# Altium project Inverter_AXIOMA_ REVERS.PrjPcb
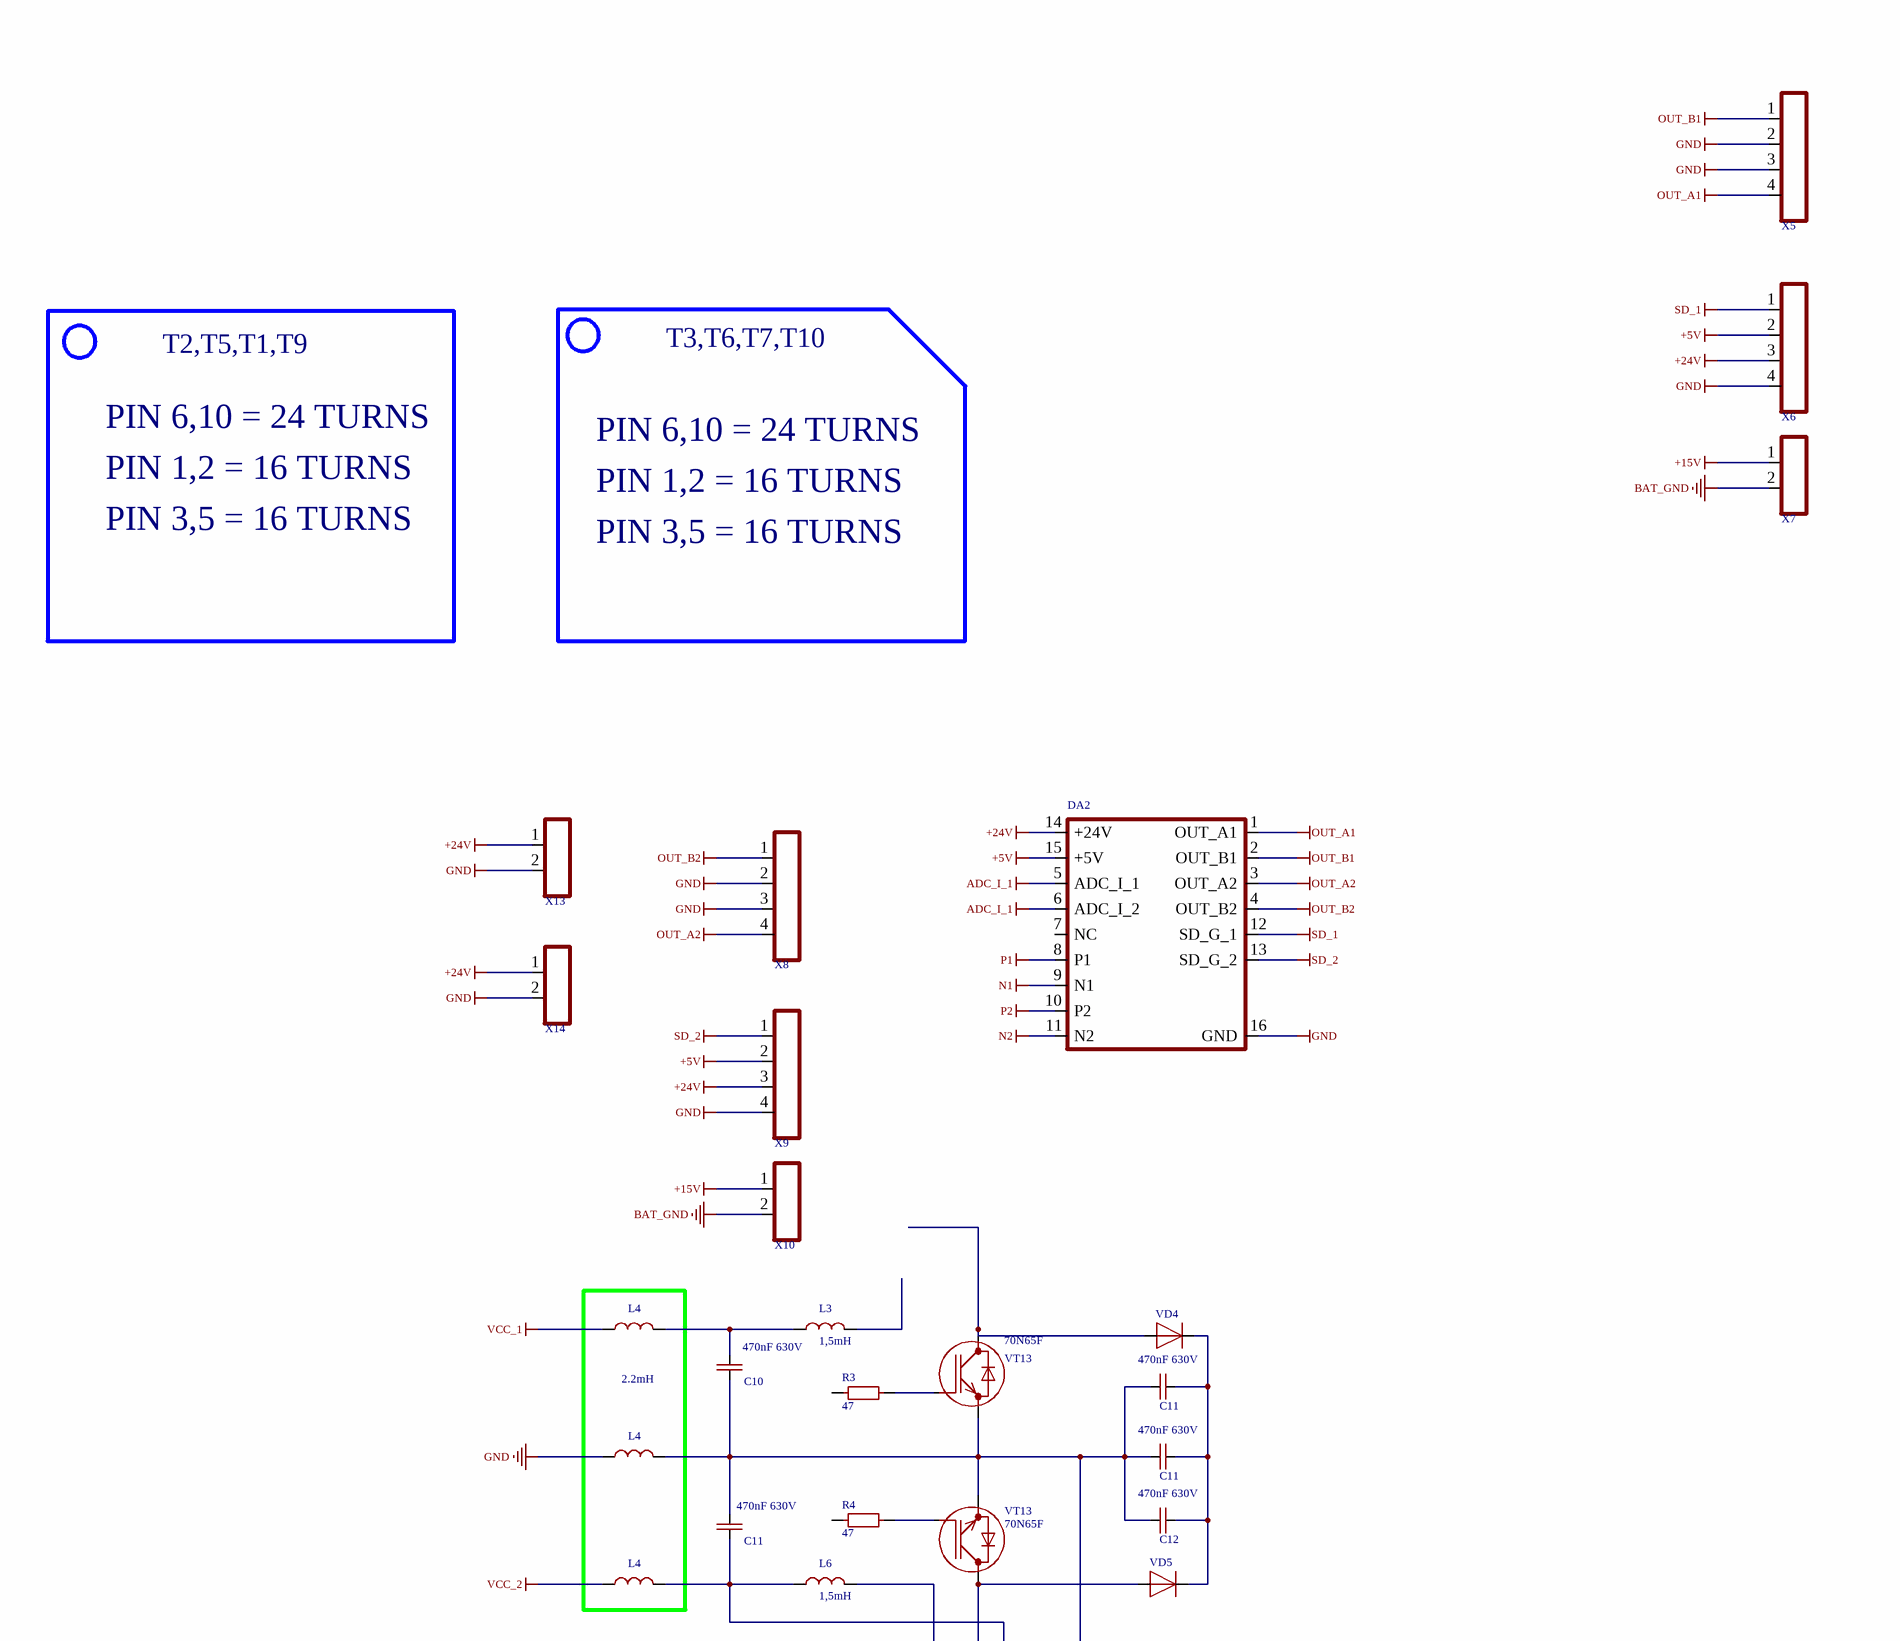
[diagram p0: Inverter_AXIOMA_ REVERS.SchDoc, top left]
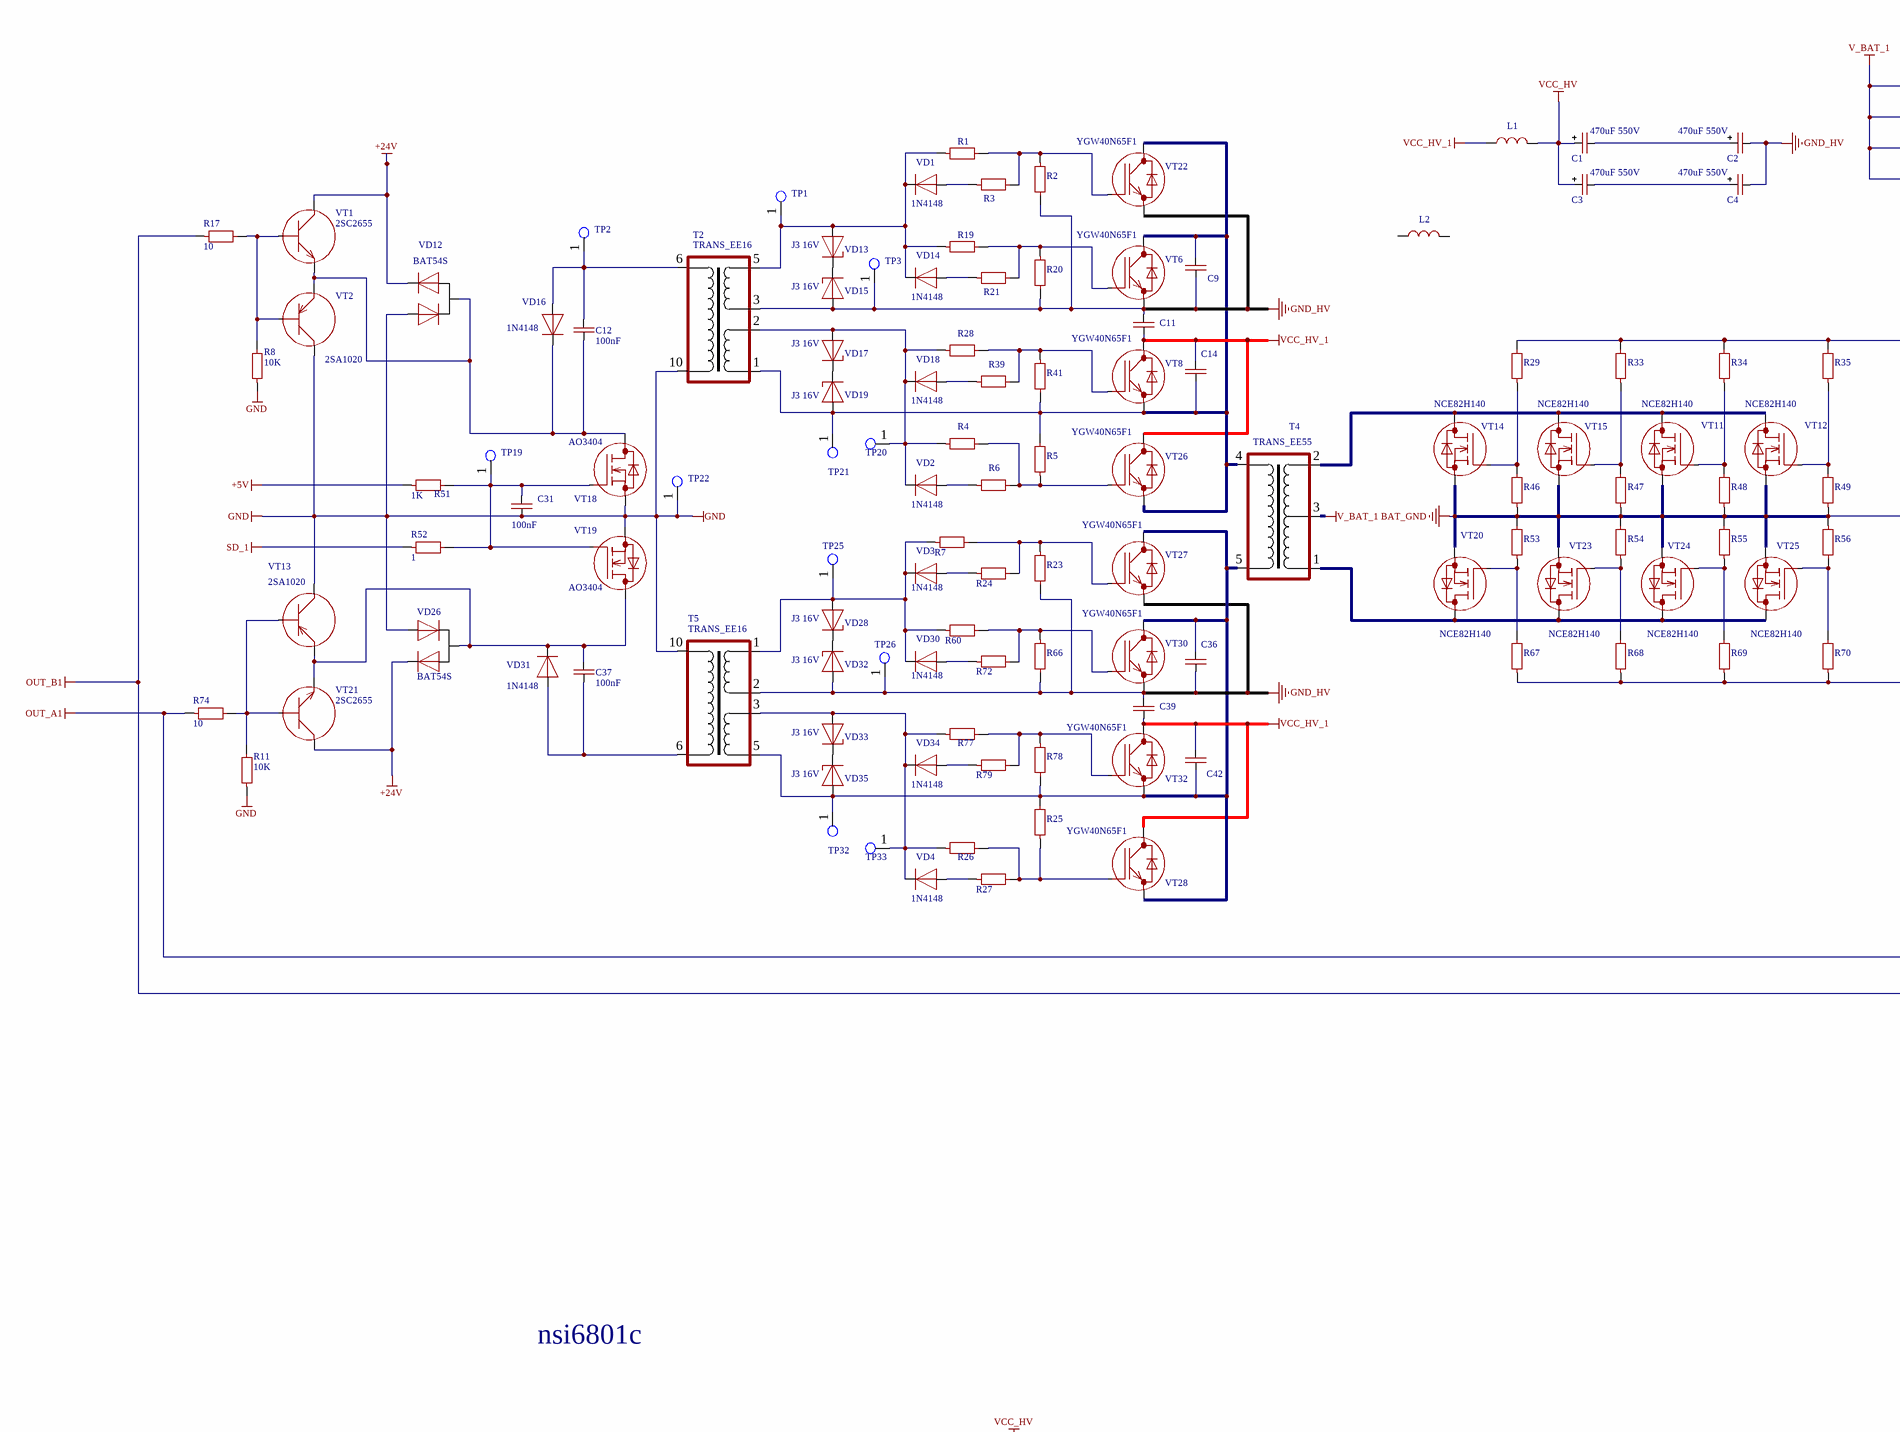
[diagram p1: Inverter_AXIOMA_ REVERS.SchDoc, top middle]
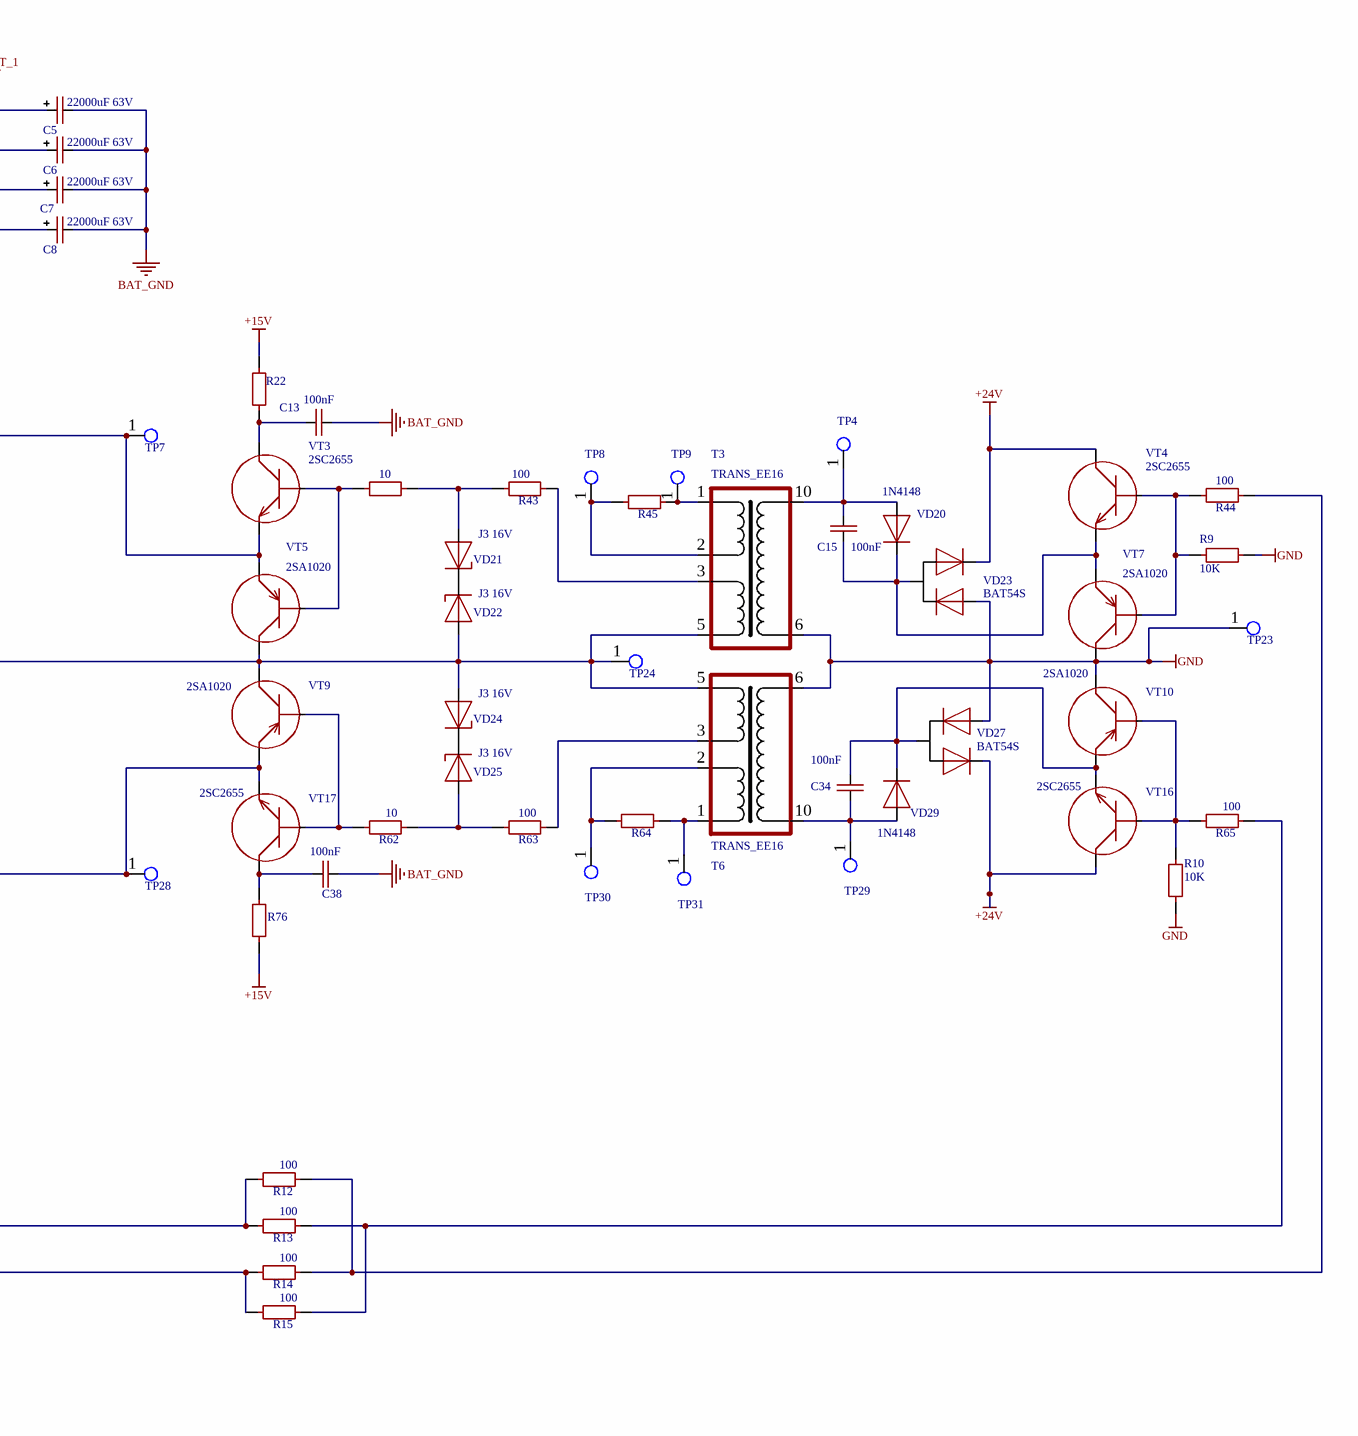
[diagram p2: Inverter_AXIOMA_ REVERS.SchDoc, top right]
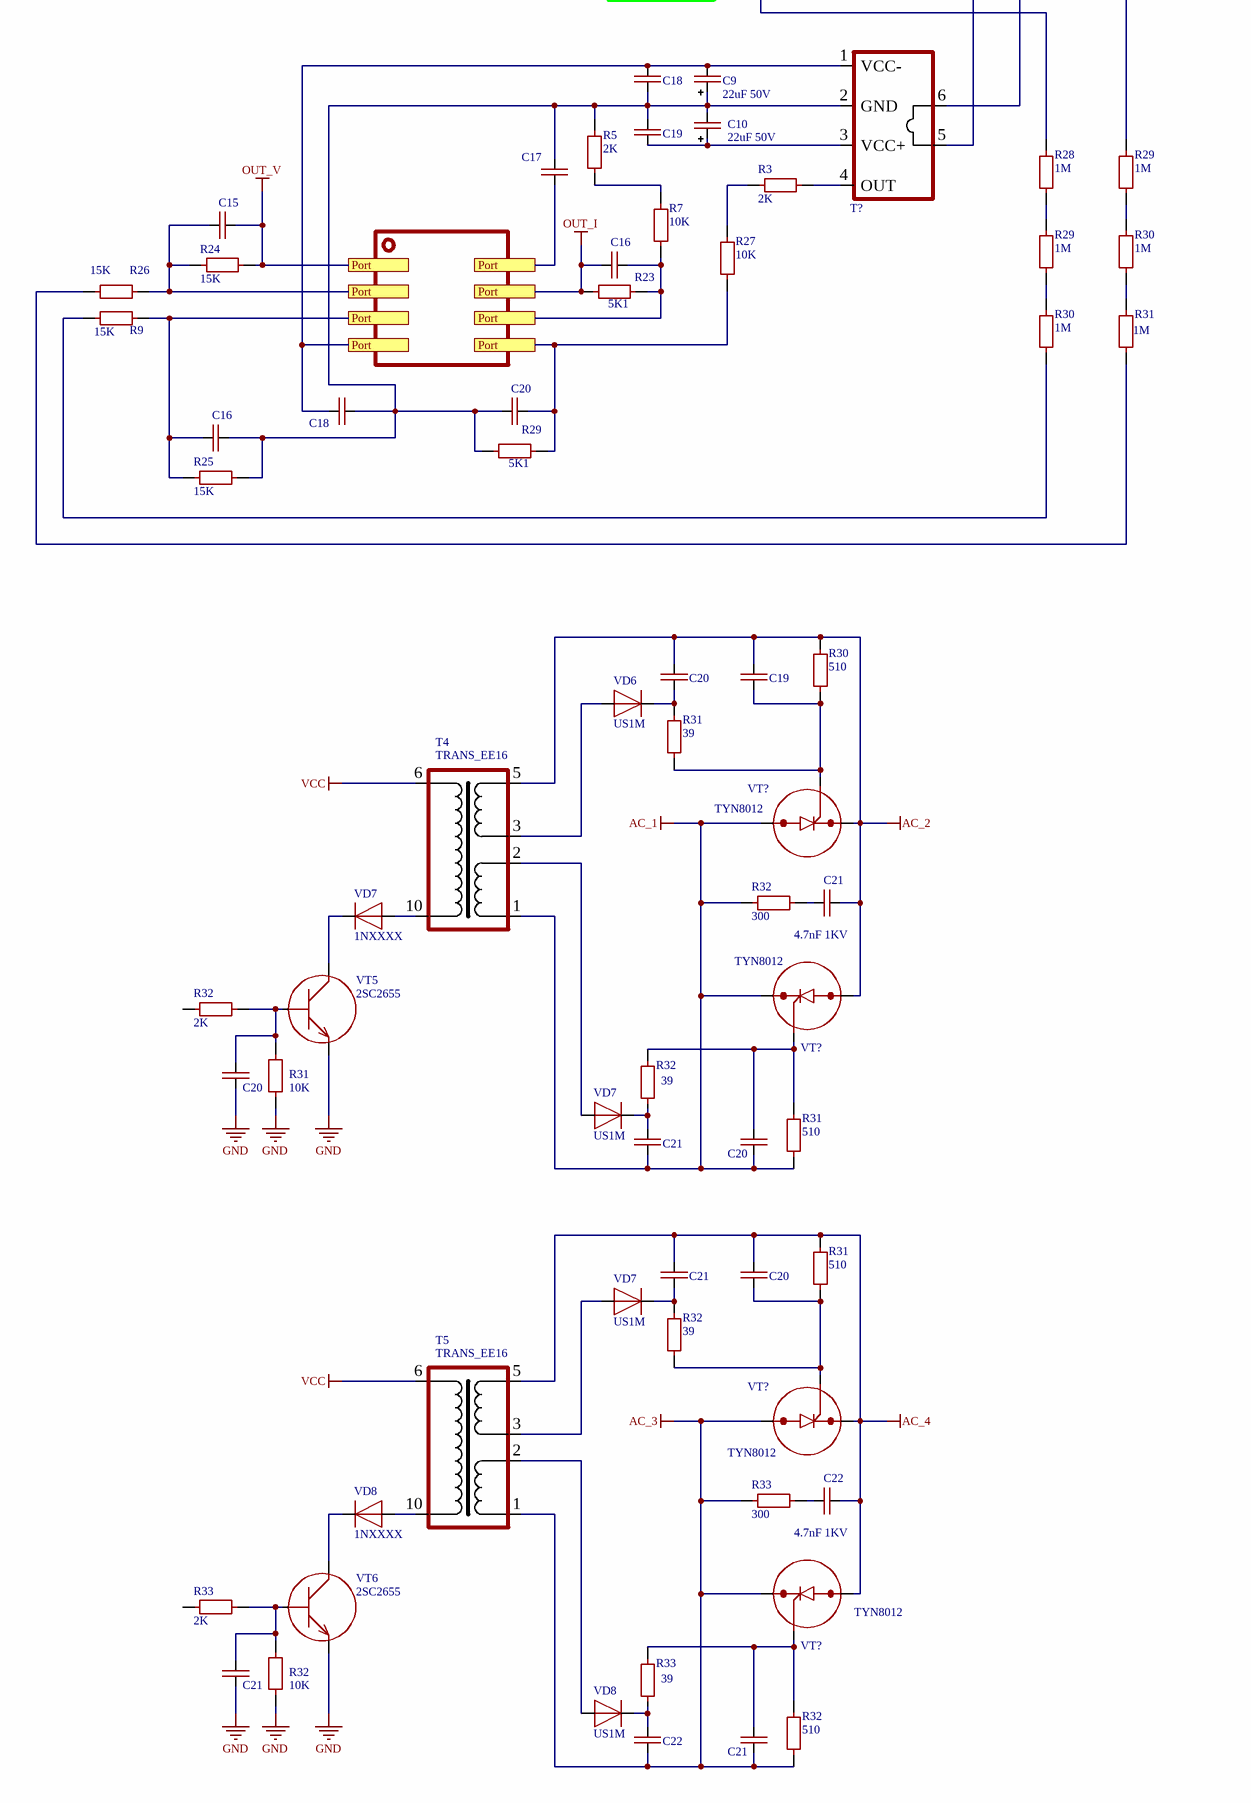
[diagram p3: Inverter_AXIOMA_ REVERS.SchDoc, bottom left]
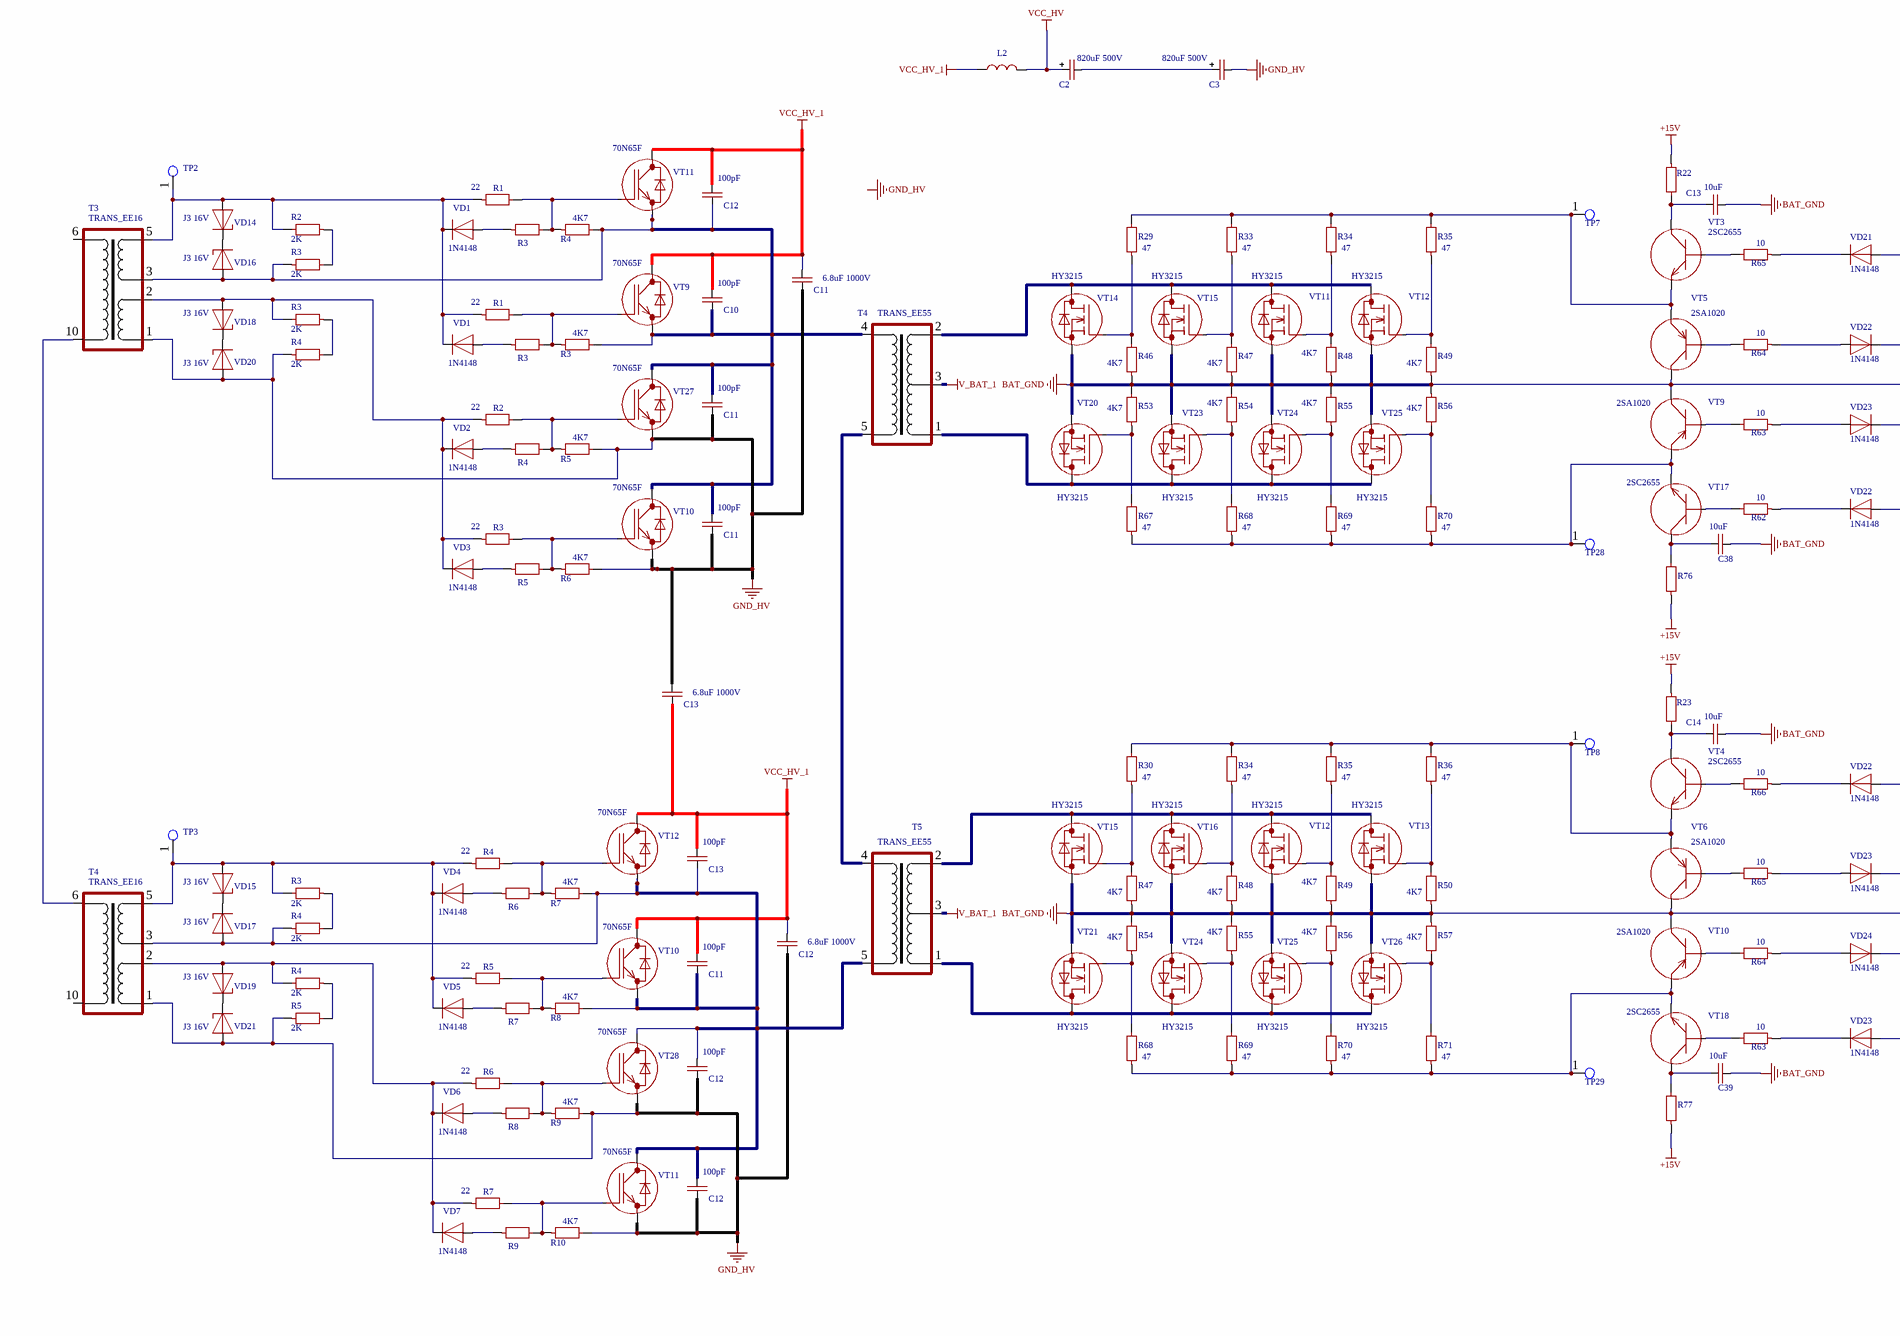
[diagram p4: Inverter_AXIOMA_ REVERS.SchDoc, bottom middle]
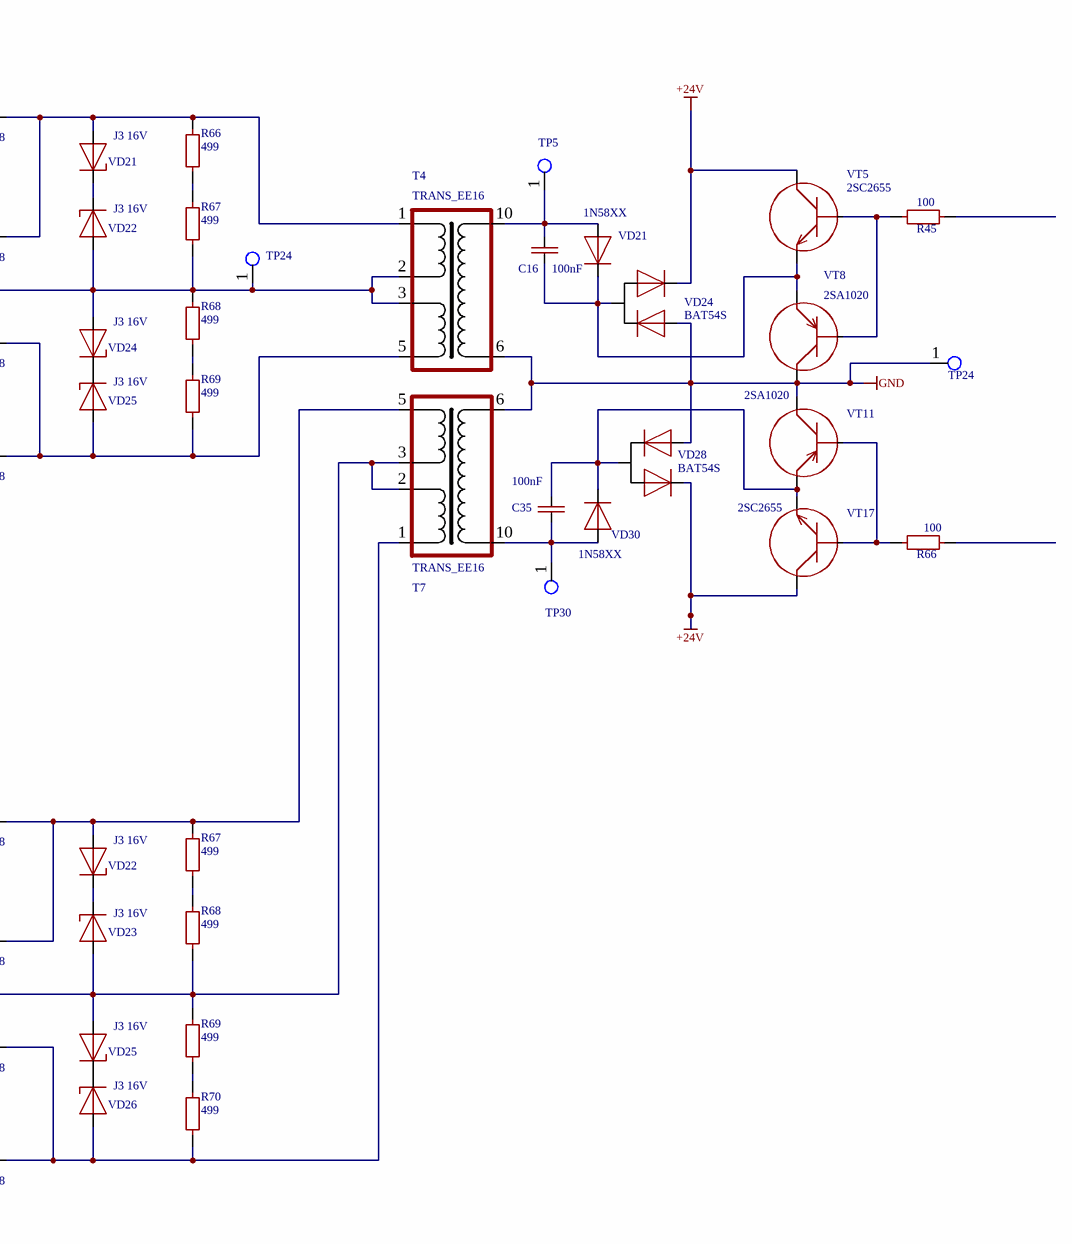
[diagram p5: Inverter_AXIOMA_ REVERS.SchDoc, bottom right]
1 sheet, 455 parts. Net scope: flat (ports and power ports of the same name join across sheets).
Board file: Inverter_AXIOMA_ REVERS.PcbDoc

## Sheet Inverter_AXIOMA_ REVERS.SchDoc
size A0; SheetNumber: 1; SheetTotal: 1; SPICEModelCacheYQEDCYZF: <root> / <DocumentId>YQEDCYZF</DocumentId> / </root>

### Parts
(Parts that share a designator on the sheet are numbered #1, #2 ... from top to bottom, then left to right.)
?  10  [RES-0805]
C1  470uF 550V  [CAPPOL-65x35]
C2#1  470uF 550V  [CAPPOL-65x35]
C2#2  820uF 500V  [CAPPOL-65x35]
C3#1  470uF 550V  [CAPPOL-65x35]
C3#2  820uF 500V  [CAPPOL-65x35]
C4  470uF 550V  [CAPPOL-65x35]
C5  22000uF 63V  [CAPPOL-100x35]
C6  22000uF 63V  [CAPPOL-100x35]
C7  22000uF 63V  [CAPPOL-100x35]
C8  22000uF 63V  [CAPPOL-100x35]
C9#1  CAP-NON-POLAR  [CAP-FILM-22.5X26.5X10]  (value not drawn)
C9#2  22uF 50V  [CAPPOL_SMD_SIZE_E]
C10#1  470nF 630V  [CAP-FILM-22.5X26.5X10]
C10#2  22uF 50V  [CAPPOL_SMD_SIZE_E]
C10#3  100pF  [CAP-FILM-22.5X26.5X10]
C11#1  CAP-NON-POLAR  [CAP-FILM-22.5X26.5X10]  (value not drawn)
C11#2  470nF 630V  [CAP-FILM-22.5X26.5X10]
C11#3  470nF 630V  [CAP-FILM-22.5X26.5X10]
C11#4  470nF 630V  [CAP-FILM-22.5X26.5X10]
C11#5  6.8uF 1000V  [CAP-FILM-22.5X26.5X10]
C11#6  100pF  [CAP-FILM-22.5X26.5X10]
C11#7  100pF  [CAP-FILM-22.5X26.5X10]
C11#8  100pF  [CAP-FILM-22.5X26.5X10]
C12#1  100nF  [CAP-1206]
C12#2  470nF 630V  [CAP-FILM-22.5X26.5X10]
C12#3  100pF  [CAP-FILM-22.5X26.5X10]
C12#4  6.8uF 1000V  [CAP-FILM-22.5X26.5X10]
C12#5  100pF  [CAP-FILM-22.5X26.5X10]
C12#6  100pF  [CAP-FILM-22.5X26.5X10]
C13#1  100nF  [CAP-0805]
C13#2  10uF  [CAP-0805]
C13#3  6.8uF 1000V  [CAP-FILM-22.5X26.5X10]
C13#4  100pF  [CAP-FILM-22.5X26.5X10]
C14#1  CAP-NON-POLAR  [CAP-FILM-22.5X26.5X10]  (value not drawn)
C14#2  10uF  [CAP-0805]
C15#1  100nF  [CAP-1206]
C15#2  (no value)  [CAP-1206]
C16#1  (no value)  [CAP-1206]
C16#2  100nF  [CAP-1206]
C16#3  (no value)  [CAP-1206]
C17  (no value)  [CAP-1206]
C18#1  (no value)  [CAP-1206]
C18#2  (no value)  [CAP-1206]
C19#1  (no value)  [CAP-1206]
C19#2  (no value)  [CAP-1206]
C20#1  (no value)  [CAP-1206]
C20#2  (no value)  [CAP-1206]
C20#3  (no value)  [CAP-1206]
C20#4  (no value)  [CAP-1206]
C20#5  (no value)  [CAP-1206]
C21#1  4.7nF 1KV  [CAP-1206]
C21#2  (no value)  [CAP-1206]
C21#3  (no value)  [CAP-1206]
C21#4  (no value)  [CAP-1206]
C21#5  (no value)  [CAP-1206]
C22#1  4.7nF 1KV  [CAP-1206]
C22#2  (no value)  [CAP-1206]
C31  100nF  [CAP-1206]
C34  100nF  [CAP-1206]
C35  100nF  [CAP-1206]
C36  CAP-NON-POLAR  [CAP-FILM-22.5X26.5X10]  (value not drawn)
C37  100nF  [CAP-1206]
C38#1  100nF  [CAP-0805]
C38#2  10uF  [CAP-0805]
C39#1  CAP-NON-POLAR  [CAP-FILM-22.5X26.5X10]  (value not drawn)
C39#2  10uF  [CAP-0805]
C42  CAP-NON-POLAR  [CAP-FILM-22.5X26.5X10]  (value not drawn)
DA2  PWM_X2_SG3525  [PWM_X2_SG3525]  (value not drawn)
L1  IND-CONST  [DROSSEL_TOR_50X30X20]  (value not drawn)
L2#1  IND-CONST  [DROSSEL_TOR_50X30X20]  (value not drawn)
L2#2  IND-CONST  [DROSSEL_TOR_50X30X20]  (value not drawn)
L3  1,5mH  [DROSSEL_TOR_50X30X20]
L4#1  2.2mH  [DROSSEL_TOR_50X30X20]
L4#2  IND-CONST  [DROSSEL_TOR_50X30X20]  (value not drawn)
L4#3  IND-CONST  [DROSSEL_TOR_50X30X20]  (value not drawn)
L6  1,5mH  [DROSSEL_TOR_50X30X20]
R1#1  RES-CONST  [RES-0805]  (value not drawn)
R1#2  22  [RES-0805]
R1#3  22  [RES-0805]
R2#1  RES-CONST  [RES-0805]  (value not drawn)
R2#2  2K  [RES-0805]
R2#3  22  [RES-0805]
R3#1  RES-CONST  [RES-0805]  (value not drawn)
R3#2  47  [RES-0805]
R3#3  2K  [RES-0805]
R3#4  RES-CONST  [RES-0805]  (value not drawn)
R3#5  2K  [RES-0805]
R3#6  2K  [RES-0805]
R3#7  RES-CONST  [RES-0805]  (value not drawn)
R3#8  4K7  [RES-0805]
R3#9  22  [RES-0805]
R3#10  2K  [RES-0805]
R4#1  RES-CONST  [RES-0805]  (value not drawn)
R4#2  47  [RES-0805]
R4#3  4K7  [RES-0805]
R4#4  2K  [RES-0805]
R4#5  RES-CONST  [RES-0805]  (value not drawn)
R4#6  22  [RES-0805]
R4#7  2K  [RES-0805]
R4#8  2K  [RES-0805]
R5#1  RES-CONST  [RES-0805]  (value not drawn)
R5#2  2K  [RES-0805]
R5#3  4K7  [RES-0805]
R5#4  RES-CONST  [RES-0805]  (value not drawn)
R5#5  22  [RES-0805]
R5#6  2K  [RES-0805]
R6#1  RES-CONST  [RES-0805]  (value not drawn)
R6#2  4K7  [RES-0805]
R6#3  RES-CONST  [RES-0805]  (value not drawn)
R6#4  22  [RES-0805]
R7#1  RES-CONST  [RES-0805]  (value not drawn)
R7#2  10K  [RES-0805]
R7#3  4K7  [RES-0805]
R7#4  RES-CONST  [RES-0805]  (value not drawn)
R7#5  22  [RES-0805]
R8#1  10K  [RES-0805]
R8#2  4K7  [RES-0805]
R8#3  RES-CONST  [RES-0805]  (value not drawn)
R9#1  10K  [RES-0805]
R9#2  15K  [RES-0805]
R9#3  4K7  [RES-0805]
R9#4  RES-CONST  [RES-0805]  (value not drawn)
R10#1  10K  [RES-0805]
R10#2  4K7  [RES-0805]
R11  10K  [RES-0805]
R12  100  [RES-0805]
R13  100  [RES-0805]
R14  100  [RES-0805]
R15  100  [RES-0805]
R17  10  [RES-0805]
R19  RES-CONST  [RES-0805]  (value not drawn)
R20  RES-CONST  [RES-0805]  (value not drawn)
R21  RES-CONST  [RES-0805]  (value not drawn)
R22#1  RES-CONST  [RES-2512]  (value not drawn)
R22#2  RES-CONST  [RES-2512]  (value not drawn)
R23#1  RES-CONST  [RES-0805]  (value not drawn)
R23#2  5K1  [RES-0805]
R23#3  RES-CONST  [RES-2512]  (value not drawn)
R24#1  RES-CONST  [RES-0805]  (value not drawn)
R24#2  15K  [RES-0805]
R25#1  RES-CONST  [RES-0805]  (value not drawn)
R25#2  15K  [RES-0805]
R26#1  RES-CONST  [RES-0805]  (value not drawn)
R26#2  15K  [RES-0805]
R27#1  RES-CONST  [RES-0805]  (value not drawn)
R27#2  10K  [RES-0805]
R28#1  RES-CONST  [RES-0805]  (value not drawn)
R28#2  1M  [RES-0805]
R29#1  RES-CONST  [RES-0805]  (value not drawn)
R29#2  1M  [RES-0805]
R29#3  1M  [RES-0805]
R29#4  47  [RES-0805]
R29#5  5K1  [RES-0805]
R30#1  1M  [RES-0805]
R30#2  1M  [RES-0805]
R30#3  510  [RES-0805]
R30#4  47  [RES-0805]
R31#1  1M  [RES-0805]
R31#2  39  [RES-0805]
R31#3  10K  [RES-0805]
R31#4  510  [RES-0805]
R31#5  510  [RES-0805]
R32#1  300  [RES-0805]
R32#2  2K  [RES-0805]
R32#3  39  [RES-0805]
R32#4  39  [RES-0805]
R32#5  10K  [RES-0805]
R32#6  510  [RES-0805]
R33#1  RES-CONST  [RES-0805]  (value not drawn)
R33#2  47  [RES-0805]
R33#3  300  [RES-0805]
R33#4  2K  [RES-0805]
R33#5  39  [RES-0805]
R34#1  RES-CONST  [RES-0805]  (value not drawn)
R34#2  47  [RES-0805]
R34#3  47  [RES-0805]
R35#1  RES-CONST  [RES-0805]  (value not drawn)
R35#2  47  [RES-0805]
R35#3  47  [RES-0805]
R36  47  [RES-0805]
R39  RES-CONST  [RES-0805]  (value not drawn)
R41  RES-CONST  [RES-0805]  (value not drawn)
R43  100  [RES-0805]
R44  100  [RES-0805]
R45#1  RES-CONST  [RES-2512]  (value not drawn)
R45#2  100  [RES-0805]
R46#1  RES-CONST  [RES-0805]  (value not drawn)
R46#2  4K7  [RES-0805]
R47#1  RES-CONST  [RES-0805]  (value not drawn)
R47#2  4K7  [RES-0805]
R47#3  4K7  [RES-0805]
R48#1  RES-CONST  [RES-0805]  (value not drawn)
R48#2  4K7  [RES-0805]
R48#3  4K7  [RES-0805]
R49#1  RES-CONST  [RES-0805]  (value not drawn)
R49#2  4K7  [RES-0805]
R49#3  4K7  [RES-0805]
R50  4K7  [RES-0805]
R51  1K  [RES-0805]
R52  1  [RES-0805]
R53#1  RES-CONST  [RES-0805]  (value not drawn)
R53#2  4K7  [RES-0805]
R54#1  RES-CONST  [RES-0805]  (value not drawn)
R54#2  4K7  [RES-0805]
R54#3  4K7  [RES-0805]
R55#1  RES-CONST  [RES-0805]  (value not drawn)
R55#2  4K7  [RES-0805]
R55#3  4K7  [RES-0805]
R56#1  RES-CONST  [RES-0805]  (value not drawn)
R56#2  4K7  [RES-0805]
R56#3  4K7  [RES-0805]
R57  4K7  [RES-0805]
R60  RES-CONST  [RES-0805]  (value not drawn)
R62#1  10  [RES-0805]
R62#2  10  [RES-0805]
R63#1  100  [RES-0805]
R63#2  10  [RES-0805]
R63#3  10  [RES-0805]
R64#1  RES-CONST  [RES-2512]  (value not drawn)
R64#2  10  [RES-0805]
R64#3  10  [RES-0805]
R65#1  100  [RES-0805]
R65#2  10  [RES-0805]
R65#3  10  [RES-0805]
R66#1  RES-CONST  [RES-0805]  (value not drawn)
R66#2  499  [RES-0805]
R66#3  100  [RES-0805]
R66#4  10  [RES-0805]
R67#1  RES-CONST  [RES-0805]  (value not drawn)
R67#2  499  [RES-0805]
R67#3  47  [RES-0805]
R67#4  499  [RES-0805]
R68#1  RES-CONST  [RES-0805]  (value not drawn)
R68#2  499  [RES-0805]
R68#3  47  [RES-0805]
R68#4  499  [RES-0805]
R68#5  47  [RES-0805]
R69#1  RES-CONST  [RES-0805]  (value not drawn)
R69#2  499  [RES-0805]
R69#3  47  [RES-0805]
R69#4  499  [RES-0805]
R69#5  47  [RES-0805]
R70#1  RES-CONST  [RES-0805]  (value not drawn)
R70#2  47  [RES-0805]
R70#3  499  [RES-0805]
R70#4  47  [RES-0805]
R71  47  [RES-0805]
R72  RES-CONST  [RES-0805]  (value not drawn)
R74  10  [RES-0805]
R76#1  RES-CONST  [RES-2512]  (value not drawn)
R76#2  RES-CONST  [RES-2512]  (value not drawn)
R77#1  RES-CONST  [RES-0805]  (value not drawn)
R77#2  RES-CONST  [RES-2512]  (value not drawn)
R78  RES-CONST  [RES-0805]  (value not drawn)
R79  RES-CONST  [RES-0805]  (value not drawn)
T2  TRANS_EE16  [TRANS_EE16]
T3#1  TRANS_EE16  [TRANS_EE16]
T3#2  TRANS_EE16  [TRANS_EE16]
T4#1  TRANS_EE55  [TRANS_EE55]
T4#2  TRANS_EE16  [TRANS_EE16]
T4#3  TRANS_EE55  [TRANS_EE55]
T4#4  TRANS_EE16  [TRANS_EE16]
T4#5  TRANS_EE16  [TRANS_EE16]
T5#1  TRANS_EE16  [TRANS_EE16]
T5#2  TRANS_EE55  [TRANS_EE55]
T5#3  TRANS_EE16  [TRANS_EE16]
T6  TRANS_EE16  [TRANS_EE16]
T7  TRANS_EE16  [TRANS_EE16]
T?  STB-HAA20  [STB-HAA20]  (value not drawn)
TP1  Test_Point_PCB  [Test_Point]  (value not drawn)
TP2#1  Test_Point_PCB  [Test_Point]  (value not drawn)
TP2#2  Test_Point_PCB  [Test_Point]  (value not drawn)
TP3#1  Test_Point_PCB  [Test_Point]  (value not drawn)
TP3#2  Test_Point_PCB  [Test_Point]  (value not drawn)
TP4  Test_Point_PCB  [Test_Point]  (value not drawn)
TP5  Test_Point_PCB  [Test_Point]  (value not drawn)
TP7#1  Test_Point_PCB  [Test_Point]  (value not drawn)
TP7#2  Test_Point_PCB  [Test_Point]  (value not drawn)
TP8#1  Test_Point_PCB  [Test_Point]  (value not drawn)
TP8#2  Test_Point_PCB  [Test_Point]  (value not drawn)
TP9  Test_Point_PCB  [Test_Point]  (value not drawn)
TP19  Test_Point_PCB  [Test_Point]  (value not drawn)
TP20  Test_Point_PCB  [Test_Point]  (value not drawn)
TP21  Test_Point_PCB  [Test_Point]  (value not drawn)
TP22  Test_Point_PCB  [Test_Point]  (value not drawn)
TP23  Test_Point_PCB  [Test_Point]  (value not drawn)
TP24#1  Test_Point_PCB  [Test_Point]  (value not drawn)
TP24#2  Test_Point_PCB  [Test_Point]  (value not drawn)
TP24#3  Test_Point_PCB  [Test_Point]  (value not drawn)
TP25  Test_Point_PCB  [Test_Point]  (value not drawn)
TP26  Test_Point_PCB  [Test_Point]  (value not drawn)
TP28#1  Test_Point_PCB  [Test_Point]  (value not drawn)
TP28#2  Test_Point_PCB  [Test_Point]  (value not drawn)
TP29#1  Test_Point_PCB  [Test_Point]  (value not drawn)
TP29#2  Test_Point_PCB  [Test_Point]  (value not drawn)
TP30#1  Test_Point_PCB  [Test_Point]  (value not drawn)
TP30#2  Test_Point_PCB  [Test_Point]  (value not drawn)
TP31  Test_Point_PCB  [Test_Point]  (value not drawn)
TP32  Test_Point_PCB  [Test_Point]  (value not drawn)
TP33  Test_Point_PCB  [Test_Point]  (value not drawn)
VD1#1  1N4148  [SOD-123]
VD1#2  1N4148  [SOD-123]
VD1#3  1N4148  [SOD-123]
VD2#1  1N4148  [SOD-123]
VD2#2  1N4148  [SOD-123]
VD3#1  1N4148  [SOD-123]
VD3#2  1N4148  [SOD-123]
VD4#1  1N4148  [SOD-123]
VD4#2  (no value)  [SOD-123]
VD4#3  1N4148  [SOD-123]
VD5#1  (no value)  [SOD-123]
VD5#2  1N4148  [SOD-123]
VD6#1  US1M  [DO-214AC, SMA]
VD6#2  1N4148  [SOD-123]
VD7#1  1NXXXX  [DO-214AC, SMA]
VD7#2  US1M  [DO-214AC, SMA]
VD7#3  US1M  [DO-214AC, SMA]
VD7#4  1N4148  [SOD-123]
VD8#1  1NXXXX  [DO-214AC, SMA]
VD8#2  US1M  [DO-214AC, SMA]
VD12  BAT54S  [SOT23-3]
VD13  J3 16V  [SOD-80]
VD14#1  1N4148  [SOD-123]
VD14#2  J3 16V  [SOD-80]
VD15#1  J3 16V  [SOD-80]
VD15#2  J3 16V  [SOD-80]
VD16#1  1N4148  [SOD-123]
VD16#2  J3 16V  [SOD-80]
VD17#1  J3 16V  [SOD-80]
VD17#2  J3 16V  [SOD-80]
VD18#1  1N4148  [SOD-123]
VD18#2  J3 16V  [SOD-80]
VD19#1  J3 16V  [SOD-80]
VD19#2  J3 16V  [SOD-80]
VD20#1  1N4148  [SOD-123]
VD20#2  J3 16V  [SOD-80]
VD21#1  J3 16V  [SOD-80]
VD21#2  1N4148  [SOD-123]
VD21#3  J3 16V  [SOD-80]
VD21#4  1N58XX  [SOD-123]
VD21#5  J3 16V  [SOD-80]
VD22#1  J3 16V  [SOD-80]
VD22#2  J3 16V  [SOD-80]
VD22#3  1N4148  [SOD-123]
VD22#4  1N4148  [SOD-123]
VD22#5  1N4148  [SOD-123]
VD22#6  J3 16V  [SOD-80]
VD23#1  BAT54S  [SOT23-3]
VD23#2  1N4148  [SOD-123]
VD23#3  J3 16V  [SOD-80]
VD23#4  1N4148  [SOD-123]
VD23#5  1N4148  [SOD-123]
VD24#1  J3 16V  [SOD-80]
VD24#2  BAT54S  [SOT23-3]
VD24#3  J3 16V  [SOD-80]
VD24#4  1N4148  [SOD-123]
VD25#1  J3 16V  [SOD-80]
VD25#2  J3 16V  [SOD-80]
VD25#3  J3 16V  [SOD-80]
VD26#1  BAT54S  [SOT23-3]
VD26#2  J3 16V  [SOD-80]
VD27  BAT54S  [SOT23-3]
VD28#1  J3 16V  [SOD-80]
VD28#2  BAT54S  [SOT23-3]
VD29  1N4148  [SOD-123]
VD30#1  1N4148  [SOD-123]
VD30#2  1N58XX  [SOD-123]
VD31  1N4148  [SOD-123]
VD32  J3 16V  [SOD-80]
VD33  J3 16V  [SOD-80]
VD34  1N4148  [SOD-123]
VD35  J3 16V  [SOD-80]
VT1  2SC2655  [SOT-89]
VT2  2SA1020  [SOT-89]
VT3#1  2SC2655  [SOT-89]
VT3#2  2SC2655  [SOT-89]
VT4#1  2SC2655  [SOT-89]
VT4#2  2SC2655  [SOT-89]
VT5#1  2SA1020  [SOT-89]
VT5#2  2SC2655  [SOT-89]
VT5#3  2SA1020  [SOT-89]
VT5#4  2SC2655  [SOT-89]
VT6#1  YGW40N65F1  [TO-247-3]
VT6#2  2SA1020  [SOT-89]
VT6#3  2SC2655  [SOT-89]
VT7  2SA1020  [SOT-89]
VT8#1  YGW40N65F1  [TO-247-3]
VT8#2  2SA1020  [SOT-89]
VT9#1  2SA1020  [SOT-89]
VT9#2  70N65F  [TO-247-3]
VT9#3  2SA1020  [SOT-89]
VT10#1  2SA1020  [SOT-89]
VT10#2  70N65F  [TO-247-3]
VT10#3  2SA1020  [SOT-89]
VT10#4  70N65F  [TO-247-3]
VT11#1  NCE82H140  [TO-247-3]
VT11#2  70N65F  [TO-247-3]
VT11#3  HY3215  [TO-247-3]
VT11#4  2SA1020  [SOT-89]
VT11#5  70N65F  [TO-247-3]
VT12#1  NCE82H140  [TO-247-3]
VT12#2  HY3215  [TO-247-3]
VT12#3  70N65F  [TO-247-3]
VT12#4  HY3215  [TO-247-3]
VT13#1  2SA1020  [SOT-89]
VT13#2  70N65F  [TO-247-3]
VT13#3  70N65F  [TO-247-3]
VT13#4  HY3215  [TO-247-3]
VT14#1  NCE82H140  [TO-247-3]
VT14#2  HY3215  [TO-247-3]
VT15#1  NCE82H140  [TO-247-3]
VT15#2  HY3215  [TO-247-3]
VT15#3  HY3215  [TO-247-3]
VT16#1  2SC2655  [SOT-89]
VT16#2  HY3215  [TO-247-3]
VT17#1  2SC2655  [SOT-89]
VT17#2  2SC2655  [SOT-89]
VT17#3  2SC2655  [SOT-89]
VT18#1  AO3404  [SOT23-3]
VT18#2  2SC2655  [SOT-89]
VT19  AO3404  [SOT23-3]
VT20#1  NCE82H140  [TO-247-3]
VT20#2  HY3215  [TO-247-3]
VT21#1  2SC2655  [SOT-89]
VT21#2  HY3215  [TO-247-3]
VT22  YGW40N65F1  [TO-247-3]
VT23#1  NCE82H140  [TO-247-3]
VT23#2  HY3215  [TO-247-3]
VT24#1  NCE82H140  [TO-247-3]
VT24#2  HY3215  [TO-247-3]
VT24#3  HY3215  [TO-247-3]
VT25#1  NCE82H140  [TO-247-3]
VT25#2  HY3215  [TO-247-3]
VT25#3  HY3215  [TO-247-3]
VT26#1  YGW40N65F1  [TO-247-3]
VT26#2  HY3215  [TO-247-3]
VT27#1  YGW40N65F1  [TO-247-3]
VT27#2  70N65F  [TO-247-3]
VT28#1  YGW40N65F1  [TO-247-3]
VT28#2  70N65F  [TO-247-3]
VT30  YGW40N65F1  [TO-247-3]
VT32  YGW40N65F1  [TO-247-3]
VT?#1  TYN8012  [TO-247-3]
VT?#2  TYN8012  [TO-247-3]
VT?#3  TYN8012  [TO-247-3]
VT?#4  TYN8012  [TO-247-3]
X5  CONN-4-PIN  [CONN-PLS-4-2.54mm_1]  (value not drawn)
X6  CONN-4-PIN  [CONN-PLS-4-2.54mm_1]  (value not drawn)
X7  CONN-2-PIN  [XH2-]  (value not drawn)
X8  CONN-4-PIN  [CONN-PLS-4-2.54mm_1]  (value not drawn)
X9  CONN-4-PIN  [CONN-PLS-4-2.54mm_1]  (value not drawn)
X10  CONN-2-PIN  [XH2-]  (value not drawn)
X13  CONN-2-PIN  [XH2-]  (value not drawn)
X14  CONN-2-PIN  [XH2-]  (value not drawn)

### Ports
Port

### Nets
+5V: DA2.15(+5V) R51.1 X6.2 X9.2
+15V: R22#1.1 R22#2.1 R23#3.1 R76#1.1 R76#2.1 R77#2.1 X7.1 X10.1
+24V: DA2.14(+24V) VD12.2(C) VD23#1.2(C) VD24#2.2(C) VD26#1.2(C) VD27.2(C) VD28#2.2(C) VT1.2(C) VT4#1.2(C) VT5#2.2(C) VT16#1.2(C) VT17#3.2(C) VT21#1.2(C) X6.3 X9.3 X13.1 X14.1
AC_1: C20#4.1 C21#2.2 R31#4.1 R32#1.1 T4#4.1 VT?#1.2(A) VT?#2.1(K)
AC_2: C19#2.2 C20#2.2 C21#1.1 R30#3.2 T4#4.5 VT?#1.1(K) VT?#2.2(A)
AC_3: C21#5.1 C22#2.2 R32#6.1 R33#3.1 T5#3.1 VT?#3.2(A) VT?#4.1(K)
AC_4: C20#5.2 C21#3.2 C22#1.1 R31#5.2 T5#3.5 VT?#3.1(K) VT?#4.2(A)
ADC_I_1: DA2.5(ADC_I_1) DA2.6(ADC_I_2)
BAT_GND: C5.2(-) C6.2(-) C7.2(-) C8.2(-) C13#1.1 C13#2.1 C14#2.1 C38#1.1 C38#2.1 C39#2.1 R46#1.1 R46#2.1 R47#1.1 R47#2.1 R47#3.1 R48#1.1 R48#2.1 R48#3.1 R49#1.1 R49#2.1 R49#3.1 R50.1 R53#1.2 R53#2.2 R54#1.2 R54#2.2 R54#3.2 R55#1.2 R55#2.2 R55#3.2 R56#1.1 R56#2.1 R56#3.2 R57.1 R67#2.2 R68#2.1 R68#4.2 R69#4.1 T3#1.5 T4#2.2 T4#2.3 T6.5 T7.2 T7.3 TP24#1.1(G9) TP24#2.1(G9) VD22#1.2(A) VD22#2.2(A) VD23#3.2(A) VD24#1.2(A) VD24#3.2(A) VD25#3.2(A) VT5#1.2(C) VT5#3.2(C) VT6#2.2(C) VT9#1.2(C) VT9#3.2(C) VT10#3.2(C) VT11#1.3(S) VT11#3.3(S) VT12#1.3(S) VT12#2.3(S) VT12#4.3(S) VT13#4.3(S) VT14#1.3(S) VT14#2.3(S) VT15#1.3(S) VT15#2.3(S) VT15#3.3(S) VT16#2.3(S) VT20#1.3(S) VT20#2.3(S) VT21#2.3(S) VT23#1.3(S) VT23#2.3(S) VT24#1.3(S) VT24#2.3(S) VT24#3.3(S) VT25#1.3(S) VT25#2.3(S) VT25#3.3(S) VT26#2.3(S) X7.2 X10.2
GND: C20#3.1 C21#4.1 C31.1 DA2.16(GND) L4#2.1 R8#1.1 R9#1.1 R10#1.1 R11.1 R31#3.1 R32#5.1 T2.10 T3#1.6 T4#2.6 T5#1.10 T6.6 T7.6 TP22.1(G9) TP23.1(G9) TP24#3.1(G9) VD12.1(A) VD23#1.1(A) VD24#2.1(A) VD26#1.1(A) VD27.1(A) VD28#2.1(A) VT2.2(C) VT5#4.3(E) VT6#3.3(E) VT7.2(C) VT8#2.2(C) VT10#1.2(C) VT11#4.2(C) VT13#1.2(C) VT18#1.2(S) VT19.2(S) X5.2 X5.3 X6.4 X8.2 X8.3 X9.4 X13.2 X14.2
GND_HV: C2#1.2(-) C3#2.2(-) C4.2(-) C9#1.1 C11#1.2 C11#5.1 C11#6.1 C11#7.1 C12#4.1 C12#5.1 C12#6.1 C13#3.2 C36.1 C39#1.2 R2#1.2 R4#4.1 R5#3.2 R5#6.1 R6#2.2 R9#3.2 R10#2.2 R20.2 R23#1.2 R66#1.2 T2.3 T3#2.1 T4#5.1 T5#1.2 TP3#1.1(G9) TP26.1(G9) VD15#1.2(A) VD20#2.2(A) VD21#5.2(A) VD32.2(A) VT6#1.3(E) VT10#2.3(E) VT11#5.3(E) VT22.3(E) VT27#1.3(E) VT27#2.3(E) VT28#2.3(E) VT30.3(E)
N1: DA2.9(N1)
N2: DA2.11(N2)
OUT_A1: DA2.1(OUT_A1) R12.2 R13.2 R74.1 X5.4
OUT_A2: DA2.3(OUT_A2) X8.4
OUT_B1: DA2.2(OUT_B1) R14.2 R15.2 R17.1 X5.1
OUT_B2: DA2.4(OUT_B2) X8.1
OUT_I: C9#2.2(-) C15#2.1 C15#2.2 C16#1.1 C16#1.2 C16#3.2 C17.1 C18#1.2 C18#2.1 C20#1.2 R7#2.2 R9#2.1 R23#2.1 R23#2.2 R24#2.1 R24#2.2 R25#2.1 R26#2.1 R27#2.2 R29#5.2 T?.1(VCC-) ; port Port  [also labelled OUT_V]
P1: DA2.8(P1)
P2: DA2.10(P2)
SD_1: DA2.12(SD_G_1) R52.1 X6.1
SD_2: DA2.13(SD_G_2) X9.1
V_BAT_1: C5.1(+) C6.1(+) C7.1(+) C8.1(+) T4#1.3 T4#3.3 T5#2.3
VCC: T4#4.6 T5#3.6
VCC_1: L4#1.1
VCC_2: L4#3.1
VCC_HV: C1.1(+) C2#2.1(+) C3#1.1(+) L1.2 L2#2.2
VCC_HV_1: C10#3.2 C11#1.1 C11#5.2 C11#8.2 C12#3.2 C12#4.2 C13#3.1 C13#4.2 C14#1.2 C39#1.1 C42.2 L1.1 L2#2.1 VT8#1.2(C) VT9#2.2(C) VT10#4.2(C) VT11#2.2(C) VT12#3.2(C) VT26#1.2(C) VT28#1.2(C) VT32.2(C)
Net?_1: ?.1 R43.2 VD21#1.2(A)
Net?_2: ?.2 VT3#1.1(B) VT5#1.1(B)
NetC1_2: C1.2(-) C2#1.1(+)
NetC2#2_2: C2#2.2(-) C3#2.1(+)
NetC3#1_2: C3#1.2(-) C4.1(+)
NetC9#1_2: C9#1.2 C14#1.1 R5#1.2 R41.2 T2.1 T4#1.4 TP21.1(G9) VD19#1.2(A) VT6#1.2(C) VT8#1.3(E) VT22.2(C) VT26#1.3(E)
NetC9#2_1: C9#2.1(+) C10#2.2(-) C16#3.1 C17.2 C18#1.1 C18#2.2 C19#1.2 C20#1.1 R5#2.1 R25#2.2 R29#5.1 T?.2(GND)
NetC10#1_1: C10#1.1 L3.1 L4#1.2
NetC10#1_2: C10#1.2 C11#2.1 C11#3.1 C11#4.1 C12#2.1 L4#2.2 R29#2.1 VT13#2.3(E) VT13#3.3(E)
NetC10#2_1: C10#2.1(+) C19#1.1 T?.3(VCC+)
NetC10#3_1: C10#3.1 C11#6.2 C11#7.2 C12#3.1 R3#5.1 R3#8.2 R4#3.2 T3#2.3 T4#3.4 VD16#2.2(A) VT9#2.3(E) VT10#2.2(C) VT11#2.3(E) VT27#2.2(C)
NetC11#2_2: C11#2.2 C11#3.2 C12#2.2 VD4#2.1(C) VD5#1.1(C)
NetC11#4_2: C11#4.2 L4#3.2 L6.1 R28#2.1
NetC11#8_1: C11#8.1 C12#5.2 C12#6.2 C13#4.1 R4#7.1 R7#3.2 R8#2.2 T4#5.3 T5#2.5 VD17#2.2(A) VT10#4.3(E) VT11#5.2(C) VT12#3.3(E) VT28#2.2(C)
NetC12#1_1: C12#1.1 VD12.3(x) VD16#1.1(C) VT1.3(E) VT2.3(E) VT18#1.3(D)
NetC12#1_2: C12#1.2 T2.6 TP2#1.1(G9) VD16#1.2(A)
NetC13#1_2: C13#1.2 R22#1.2 VT3#1.2(C)
NetC13#2_2: C13#2.2 R22#2.2 VT3#2.2(C)
NetC14#2_2: C14#2.2 R23#3.2 VT4#2.2(C)
NetC15#1_1: C15#1.1 T3#1.10 TP4.1(G9) VD20#1.2(A)
NetC15#1_2: C15#1.2 VD20#1.1(C) VD23#1.3(x) VT4#1.3(E) VT7.3(E)
NetC16#2_1: C16#2.1 T4#2.10 TP5.1(G9) VD21#4.2(A)
NetC16#2_2: C16#2.2 VD21#4.1(C) VD24#2.3(x) VT5#2.3(E) VT8#2.3(E)
NetC19#2_1: C19#2.1 R30#3.1 R31#2.2 VT?#1.3(G)
NetC20#2_1: C20#2.1 R31#2.1 VD6#1.1(C)
NetC20#3_2: C20#3.2 R31#3.2 R32#2.1 VT5#4.1(B)
NetC20#4_2: C20#4.2 R31#4.2 R32#3.2 VT?#2.3(G)
NetC20#5_1: C20#5.1 R31#5.1 R32#4.2 VT?#3.3(G)
NetC21#1_2: C21#1.2 R32#1.2
NetC21#2_1: C21#2.1 R32#3.1 VD7#2.1(C)
NetC21#3_1: C21#3.1 R32#4.1 VD7#3.1(C)
NetC21#4_2: C21#4.2 R32#5.2 R33#4.1 VT6#3.1(B)
NetC21#5_2: C21#5.2 R32#6.2 R33#5.2 VT?#4.3(G)
NetC22#1_2: C22#1.2 R33#3.2
NetC22#2_1: C22#2.1 R33#5.1 VD8#2.1(C)
NetC31_2: C31.2 R51.2 R52.2 TP19.1(G9) VT18#1.1(G) VT19.1(G)
NetC34_1: C34.1 VD27.3(x) VD29.1(C) VT10#1.3(E) VT16#1.3(E)
NetC34_2: C34.2 T6.10 TP29#1.1(G9) VD29.2(A)
NetC35_1: C35.1 VD28#2.3(x) VD30#2.1(C) VT11#4.3(E) VT17#3.3(E)
NetC35_2: C35.2 T7.10 TP30#2.1(G9) VD30#2.2(A)
NetC36_2: C36.2 C42.1 R25#1.2 R78.2 T4#1.5 T5#1.5 TP32.1(G9) VD35.2(A) VT27#1.2(C) VT28#1.3(E) VT30.2(C) VT32.3(E)
NetC37_1: C37.1 T5#1.6 VD31.2(A)
NetC37_2: C37.2 VD26#1.3(x) VD31.1(C) VT13#1.3(E) VT19.3(D) VT21#1.3(E)
NetC38#1_2: C38#1.2 R76#1.2 VT17#1.2(C)
NetC38#2_2: C38#2.2 R76#2.2 VT17#2.2(C)
NetC39#2_2: C39#2.2 R77#2.2 VT18#2.2(C)
NetL6_2: L6.2 T?.5
NetR1#1_1: R1#1.1 R19.1 T2.5 TP1.1(G9) VD1#1.1(C) VD13.2(A) VD14#1.1(C)
NetR1#1_2: R1#1.2 R2#1.1 R3#1.2 VT22.1(G)
NetR1#2_1: R1#2.1 R1#3.1 R2#2.2 T3#2.5 TP2#2.1(G9) VD1#2.1(C) VD1#3.1(C) VD14#2.2(A)
NetR1#2_2: R1#2.2 R3#4.2 R4#3.1 VT11#2.1(G)
NetR1#3_2: R1#3.2 R3#7.2 R3#8.1 VT9#2.1(G)
NetR2#2_1: R2#2.1 R3#5.2
NetR2#3_1: R2#3.1 R3#6.2 R3#9.1 T3#2.2 VD2#2.1(C) VD3#2.1(C) VD18#2.2(A)
NetR2#3_2: R2#3.2 R4#5.2 R5#3.1 VT27#2.1(G)
NetR3#1_1: R3#1.1 VD1#1.2(A)
NetR3#2_1: R3#2.1 VT13#2.1(G)
NetR3#3_1: R3#3.1 T?.4(OUT)
NetR3#3_2: R3#3.2 R27#2.1
NetR3#4_1: R3#4.1 VD1#2.2(A)
NetR3#6_1: R3#6.1 R4#4.2
NetR3#7_1: R3#7.1 VD1#3.2(A)
NetR3#9_2: R3#9.2 R5#4.2 R6#2.1 VT10#2.1(G)
NetR3#10_1: R3#10.1 R4#7.2
NetR3#10_2: R3#10.2 R4#6.1 R5#5.1 T4#5.5 TP3#2.1(G9) VD4#3.1(C) VD5#2.1(C) VD15#2.2(A)
NetR4#1_1: R4#1.1 R28#1.1 T2.2 TP20.1(G9) VD2#1.1(C) VD17#1.2(A) VD18#1.1(C)
NetR4#1_2: R4#1.2 R5#1.1 R6#1.2 VT26#1.1(G)
NetR4#2_1: R4#2.1 VT13#3.1(G)
NetR4#5_1: R4#5.1 VD2#2.2(A)
NetR4#6_2: R4#6.2 R6#3.2 R7#3.1 VT12#3.1(G)
NetR4#8_1: R4#8.1 R5#6.2
NetR4#8_2: R4#8.2 R6#4.1 R7#5.1 T4#5.2 VD6#2.1(C) VD7#4.1(C) VD19#2.2(A)
NetR5#2_2: R5#2.2 R7#2.1
NetR5#4_1: R5#4.1 VD3#2.2(A)
NetR5#5_2: R5#5.2 R7#4.2 R8#2.1 VT10#4.1(G)
NetR6#1_1: R6#1.1 VD2#1.2(A)
NetR6#3_1: R6#3.1 VD4#3.2(A)
NetR6#4_2: R6#4.2 R8#3.2 R9#3.1 VT28#2.1(G)
NetR7#1_1: R7#1.1 R60.1 T5#1.1 TP25.1(G9) VD3#1.1(C) VD28#1.2(A) VD30#1.1(C)
NetR7#1_2: R7#1.2 R23#1.1 R24#1.2 VT27#1.1(G)
NetR7#4_1: R7#4.1 VD5#2.2(A)
NetR7#5_2: R7#5.2 R9#4.2 R10#2.1 VT11#5.1(G)
NetR8#1_2: R8#1.2 R17.2 VT1.1(B) VT2.1(B)
NetR8#3_1: R8#3.1 VD6#2.2(A)
NetR9#1_2: R9#1.2 R44.2 VT4#1.1(B) VT7.1(B)
NetR9#2_2: R9#2.2 R30#2.2
NetR9#4_1: R9#4.1 VD7#4.2(A)
NetR10#1_2: R10#1.2 R65#1.2 VT10#1.1(B) VT16#1.1(B)
NetR11_2: R11.2 R74.2 VT13#1.1(B) VT21#1.1(B)
NetR12_1: R12.1 R14.1 R44.1
NetR13_1: R13.1 R15.1 R65#1.1
NetR19_2: R19.2 R20.1 R21.2 VT6#1.1(G)
NetR21_1: R21.1 VD14#1.2(A)
NetR24#1_1: R24#1.1 VD3#1.2(A)
NetR25#1_1: R25#1.1 R26#1.2 R27#1.2 VT28#1.1(G)
NetR26#1_1: R26#1.1 R77#1.1 T5#1.3 TP33.1(G9) VD4#1.1(C) VD33.2(A) VD34.1(C)
NetR26#2_2: R26#2.2 R31#1.2
NetR27#1_1: R27#1.1 VD4#1.2(A)
NetR28#1_2: R28#1.2 R39.2 R41.1 VT8#1.1(G)
NetR28#2_2: R28#2.2 R29#3.1
NetR29#1_1: R29#1.1 R46#1.2 VT14#1.1(G)
NetR29#1_2: R29#1.2 R33#1.2 R34#1.2 R35#1.2 TP7#1.1(G9) VT3#1.3(E) VT5#1.3(E)
NetR29#2_2: R29#2.2 R30#1.1
NetR29#3_2: R29#3.2 R30#2.1
NetR29#4_1: R29#4.1 R46#2.2 VT14#2.1(G)
NetR29#4_2: R29#4.2 R33#2.2 R34#2.2 R35#2.2 TP7#2.1(G9) VT3#2.3(E) VT5#3.3(E)
NetR30#1_2: R30#1.2 R31#1.1
NetR30#4_1: R30#4.1 R47#3.2 VT15#3.1(G)
NetR30#4_2: R30#4.2 R34#3.2 R35#3.2 R36.2 TP8#2.1(G9) VT4#2.3(E) VT6#2.3(E)
NetR33#1_1: R33#1.1 R47#1.2 VT15#1.1(G)
NetR33#2_1: R33#2.1 R47#2.2 VT15#2.1(G)
NetR34#1_1: R34#1.1 R48#1.2 VT11#1.1(G)
NetR34#2_1: R34#2.1 R48#2.2 VT11#3.1(G)
NetR34#3_1: R34#3.1 R48#3.2 VT16#2.1(G)
NetR35#1_1: R35#1.1 R49#1.2 VT12#1.1(G)
NetR35#2_1: R35#2.1 R49#2.2 VT12#2.1(G)
NetR35#3_1: R35#3.1 R49#3.2 VT12#4.1(G)
NetR36_1: R36.1 R50.2 VT13#4.1(G)
NetR39_1: R39.1 VD18#1.2(A)
NetR43_1: R43.1 T3#1.3
NetR45#1_1: R45#1.1 T3#1.1 TP9.1(G9)
NetR45#1_2: R45#1.2 T3#1.2 TP8#1.1(G9)
NetR45#2_2: R45#2.2 VT5#2.1(B) VT8#2.1(B)
NetR53#1_1: R53#1.1 R67#1.2 VT20#1.1(G)
NetR53#2_1: R53#2.1 R67#3.2 VT20#2.1(G)
NetR54#1_1: R54#1.1 R68#1.2 VT23#1.1(G)
NetR54#2_1: R54#2.1 R68#3.2 VT23#2.1(G)
NetR54#3_1: R54#3.1 R68#5.2 VT21#2.1(G)
NetR55#1_1: R55#1.1 R69#1.2 VT24#1.1(G)
NetR55#2_1: R55#2.1 R69#3.2 VT24#2.1(G)
NetR55#3_1: R55#3.1 R69#5.2 VT24#3.1(G)
NetR56#1_2: R56#1.2 R70#1.2 VT25#1.1(G)
NetR56#2_2: R56#2.2 R70#2.2 VT25#2.1(G)
NetR56#3_1: R56#3.1 R70#4.2 VT25#3.1(G)
NetR57_2: R57.2 R71.2 VT26#2.1(G)
NetR60_2: R60.2 R66#1.1 R72.2 VT30.1(G)
NetR62#1_1: R62#1.1 R63#1.2 VD25#1.2(A)
NetR62#1_2: R62#1.2 VT9#1.1(B) VT17#1.1(B)
NetR62#2_1: R62#2.1 VD22#4.1(C)
NetR62#2_2: R62#2.2 VT17#2.1(B)
NetR63#1_1: R63#1.1 T6.3
NetR63#2_1: R63#2.1 VD23#2.2(A)
NetR63#2_2: R63#2.2 VT9#3.1(B)
NetR63#3_1: R63#3.1 VD23#5.1(C)
NetR63#3_2: R63#3.2 VT18#2.1(B)
NetR64#1_1: R64#1.1 T6.1 TP31.1(G9)
NetR64#1_2: R64#1.2 T6.2 TP30#1.1(G9)
NetR64#2_1: R64#2.1 VD22#3.2(A)
NetR64#2_2: R64#2.2 VT5#3.1(B)
NetR64#3_1: R64#3.1 VD24#4.2(A)
NetR64#3_2: R64#3.2 VT10#3.1(B)
NetR65#2_1: R65#2.1 VD21#2.1(C)
NetR65#2_2: R65#2.2 VT3#2.1(B)
NetR65#3_1: R65#3.1 VD23#4.2(A)
NetR65#3_2: R65#3.2 VT6#2.1(B)
NetR66#2_1: R66#2.1 T4#2.1 VD21#2.2(A) VD21#3.2(A) VD22#3.1(C)
NetR66#2_2: R66#2.2 R67#2.1
NetR66#3_2: R66#3.2 VT11#4.1(B) VT17#3.1(B)
NetR66#4_1: R66#4.1 VD22#5.1(C)
NetR66#4_2: R66#4.2 VT4#2.1(B)
NetR67#1_1: R67#1.1 R68#1.1 R69#1.1 R70#1.1 TP28#1.1(G9) VT9#1.3(E) VT17#1.3(E)
NetR67#3_1: R67#3.1 R68#3.1 R69#3.1 R70#2.1 TP28#2.1(G9) VT9#3.3(E) VT17#2.3(E)
NetR67#4_1: R67#4.1 T7.5 VD22#5.2(A) VD22#6.2(A) VD23#4.1(C)
NetR67#4_2: R67#4.2 R68#4.1
NetR68#2_2: R68#2.2 R69#2.1
NetR68#5_1: R68#5.1 R69#5.1 R70#4.1 R71.1 TP29#2.1(G9) VT10#3.3(E) VT18#2.3(E)
NetR69#2_2: R69#2.2 T4#2.5 VD22#4.2(A) VD23#2.1(C) VD25#2.2(A)
NetR69#4_2: R69#4.2 R70#3.1
NetR70#3_2: R70#3.2 T7.1 VD23#5.2(A) VD24#4.1(C) VD26#2.2(A)
NetR72_1: R72.1 VD30#1.2(A)
NetR77#1_2: R77#1.2 R78.1 R79.2 VT32.1(G)
NetR79_1: R79.1 VD34.2(A)
NetT3#2_10: T3#2.10 T4#5.6
NetT4#1_1: T4#1.1 VT20#1.2(D) VT23#1.2(D) VT24#1.2(D) VT25#1.2(D)
NetT4#1_2: T4#1.2 VT11#1.2(D) VT12#1.2(D) VT14#1.2(D) VT15#1.2(D)
NetT4#3_1: T4#3.1 VT20#2.2(D) VT23#2.2(D) VT24#2.2(D) VT25#2.2(D)
NetT4#3_2: T4#3.2 VT11#3.2(D) VT12#2.2(D) VT14#2.2(D) VT15#2.2(D)
NetT4#3_5: T4#3.5 T5#2.4
NetT4#4_2: T4#4.2 VD7#2.2(A)
NetT4#4_3: T4#4.3 VD6#1.2(A)
NetT4#4_10: T4#4.10 VD7#1.2(A)
NetT5#2_1: T5#2.1 VT21#2.2(D) VT24#3.2(D) VT25#3.2(D) VT26#2.2(D)
NetT5#2_2: T5#2.2 VT12#4.2(D) VT13#4.2(D) VT15#3.2(D) VT16#2.2(D)
NetT5#3_2: T5#3.2 VD8#2.2(A)
NetT5#3_3: T5#3.3 VD7#3.2(A)
NetT5#3_10: T5#3.10 VD8#1.2(A)
NetT?_6: T?.6 VD5#1.2(A) VT13#3.2(C)
NetVD4#2_2: VD4#2.2(A) VT13#2.2(C)
NetVD7#1_1: VD7#1.1(C) VT5#4.2(C)
NetVD8#1_1: VD8#1.1(C) VT6#3.2(C)
NetVD13_1: VD13.1(C) VD15#1.1(C)
NetVD14#2_1: VD14#2.1(C) VD16#2.1(C)
NetVD15#2_1: VD15#2.1(C) VD17#2.1(C)
NetVD17#1_1: VD17#1.1(C) VD19#1.1(C)
NetVD18#2_1: VD18#2.1(C) VD20#2.1(C)
NetVD19#2_1: VD19#2.1(C) VD21#5.1(C)
NetVD21#1_1: VD21#1.1(C) VD22#1.1(C)
NetVD21#3_1: VD21#3.1(C) VD22#2.1(C)
NetVD22#6_1: VD22#6.1(C) VD23#3.1(C)
NetVD24#1_1: VD24#1.1(C) VD25#1.1(C)
NetVD24#3_1: VD24#3.1(C) VD25#2.1(C)
NetVD25#3_1: VD25#3.1(C) VD26#2.1(C)
NetVD28#1_1: VD28#1.1(C) VD32.1(C)
NetVD33_1: VD33.1(C) VD35.1(C)

Not connected (* = marked no-connect by the designer): DA2 7(NC); L2#1 1 2; L3 2; R3#2 2; R4#2 2; R32#2 2; R33#4 2; R45#2 1; R66#3 1; T3#2 6; T4#5 10

### Notes on the sheet
- T2,T5,T1,T9
- T3,T6,T7,T10
- PIN 6,10 = 24 TURNS
- PIN 1,2 = 16 TURNS
- PIN 3,5 = 16 TURNS
- nsi6801c
- Labels drawn without touching a wire or pin: GND_HV

### Library data of the parts
? R1#2 R1#3 R2#2 R2#3 R3#2 R3#3 R3#5 R3#6 R3#8-R3#10 R4#2-R4#4 R4#6-R4#8 R5#2 R5#3 R5#5 R5#6 R6#2 R6#4 R7#2 R7#3 R7#5 R8#1 R8#2 R9#1-R9#3 R10#1 R10#2 R11-R15 R17 R23#2 R24#2 R25#2 R26#2 R27#2 R28#2 R29#2-R29#5 R30#1-R30#4 R31#1-R31#5 R32#1-R32#6 R33#2-R33#5 R34#2 R34#3 R35#2 R35#3 R36 R43 R44 R45#2 R46#2 R47#2 R47#3 R48#2 R48#3 R49#2 R49#3 R50-R52 R53#2 R54#2 R54#3 R55#2 R55#3 R56#2 R56#3 R57 R62#1 R62#2 R63#1-R63#3 R64#2 R64#3 R65#1-R65#3 R66#2-R66#4 R67#2-R67#4 R68#2-R68#5 R69#2-R69#5 R70#2-R70#4 R71 R74 = RES-CONST
C1 C2#1 C2#2 C3#1 C3#2 C4-C8 C9#2 C10#2 = CAP-POLAR
C10#1 C10#3 C11#2-C11#8 C12#1-C12#6 C13#1-C13#4 C14#2 C15#1 C15#2 C16#1-C16#3 C17 C18#1 C18#2 C19#1 C19#2 C20#1-C20#5 C21#1-C21#5 C22#1 C22#2 C31 C34 C35 C37 C38#1 C38#2 C39#2 = CAP-NON-POLAR
L3 L4#1 L6 = IND-CONST
TP1 TP2#1 TP2#2 TP3#1 TP3#2 TP4 TP5 TP7#1 TP7#2 TP8#1 TP8#2 TP9 TP19-TP23 TP24#1-TP24#3 TP25 TP26 TP28#1 TP28#2 TP29#1 TP29#2 TP30#1 TP30#2 TP31-TP33 = TP_PCB?: Test_Point
VD1#1-VD1#3 VD2#1 VD2#2 VD3#1 VD3#2 VD4#1-VD4#3 VD5#1 VD5#2 VD6#1 VD6#2 VD7#1-VD7#4 VD8#1 VD8#2 VD14#1 VD16#1 VD18#1 VD20#1 VD21#2 VD21#4 VD22#3-VD22#5 VD23#2 VD23#4 VD23#5 VD24#4 VD29 VD30#1 VD30#2 VD31 VD34 = DIODE
VD12 VD23#1 VD24#2 VD26#1 VD27 VD28#2 = DIODE-4
VD13 VD14#2 VD15#1 VD15#2 VD16#2 VD17#1 VD17#2 VD18#2 VD19#1 VD19#2 VD20#2 VD21#1 VD21#3 VD21#5 VD22#1 VD22#2 VD22#6 VD23#3 VD24#1 VD24#3 VD25#1-VD25#3 VD26#2 VD28#1 VD32 VD33 VD35 = ZENER
VT1 VT3#1 VT3#2 VT4#1 VT4#2 VT5#2 VT5#4 VT6#3 VT16#1 VT17#1-VT17#3 VT18#2 VT21#1 = BIPOLAR-NPN-BEC
VT2 VT5#1 VT5#3 VT6#2 VT7 VT8#2 VT9#1 VT9#3 VT10#1 VT10#3 VT11#4 VT13#1 = BIPOLAR-PNP-BCE
VT6#1 VT8#1 VT9#2 VT10#2 VT10#4 VT11#2 VT11#5 VT12#3 VT13#2 VT13#3 VT22 VT26#1 VT27#1 VT27#2 VT28#1 VT28#2 VT30 VT32 = IGBT-N-GCE
VT11#1 VT11#3 VT12#1 VT12#2 VT12#4 VT13#4 VT14#1 VT14#2 VT15#1-VT15#3 VT16#2 VT18#1 VT19 VT20#1 VT20#2 VT21#2 VT23#1 VT23#2 VT24#1-VT24#3 VT25#1-VT25#3 VT26#2 VT?#1-VT?#4 = MOSFET-N-GDS